# EAGLE design motor7 (EAGLE 6.1)

## Sheet 1 of 3
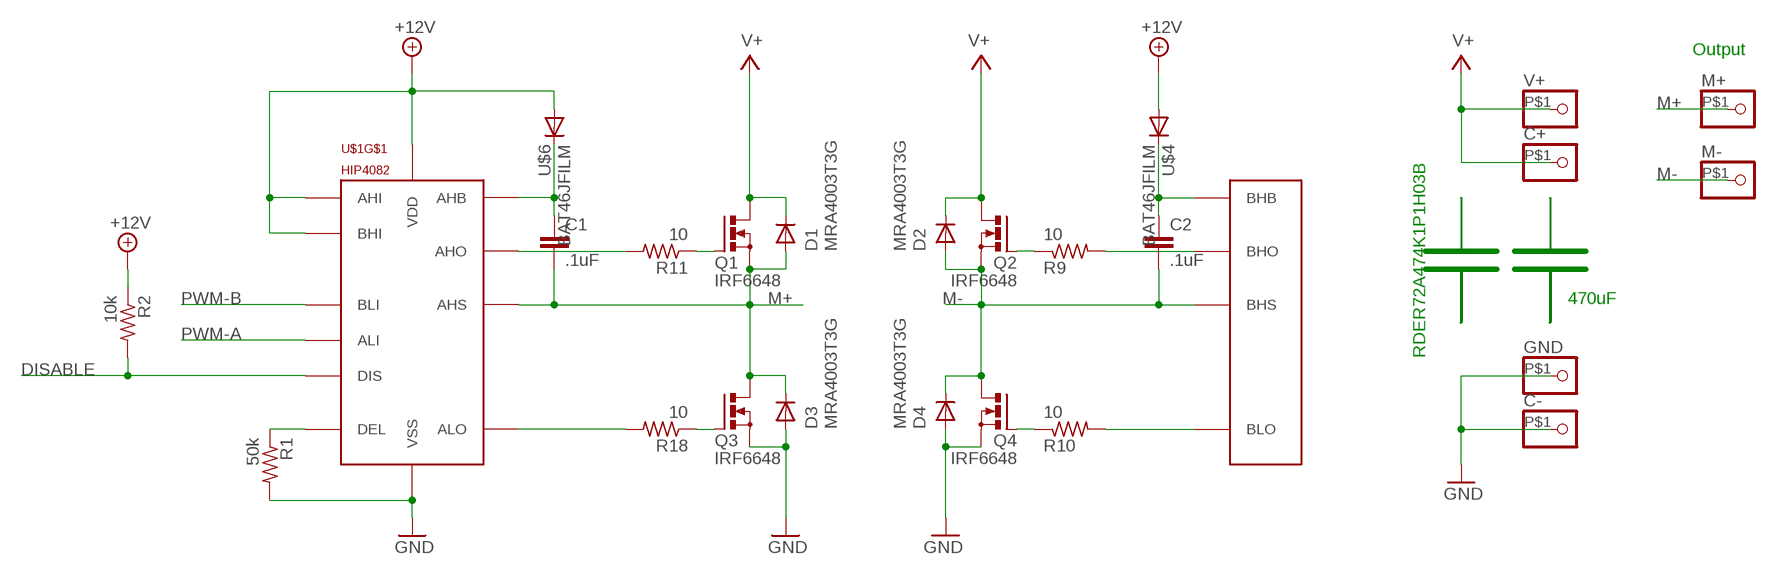
[diagram p0: schematic, sheet 1]

### Parts
C1  .1uF  C-EUC0603  [C0603]
C2  .1uF  C-EUC0603  [C0603]
C+  PINHD-1X1  [1X01]
C-  PINHD-1X1  [1X01]
D1  MRA4003T3G  [SMA]
D2  MRA4003T3G  [SMA]
D3  MRA4003T3G  [SMA]
D4  MRA4003T3G  [SMA]
GND  PINHD-1X1  [1X01]
M+  PINHD-1X1  [1X01]
M-  PINHD-1X1  [1X01]
Q1  IRF6648  [DIRECTFET-MOD]
Q2  IRF6648  [DIRECTFET-MOD]
Q3  IRF6648  [DIRECTFET]
Q4  IRF6648  [DIRECTFET]
R1  50k  R-US_R0603  [R0603]
R2  10k  R-US_R0603  [R0603]
R9  10  R-US_R0603  [R0603]
R10  10  R-US_R0603  [R0603]
R11  10  R-US_R0603  [R0603]
R18  10  R-US_R0603  [R0603]
U$1  HIP4082  [SOIC16]
U$4  BAT46JFILM  [SOD323]
U$6  BAT46JFILM  [SOD323]
V+  PINHD-1X1  [1X01]

### Nets
+12V: R2.1 U$1.2(BHI) U$1.7(AHI) U$1.12(VDD) U$4.2(A) U$6.2(A) ; also sheet 3
+48V: C+.P$1 D1.C D2.C Q1.D@1(D) Q1.D@2(D) Q1.D@3(D) Q1.D@4(D) Q2.D@1(D) Q2.D@2(D) Q2.D@3(D) Q2.D@4(D) V+.P$1 ; supply symbol labelled V+ ; also sheet 3
DISABLE: R2.2 U$1.8(DIS) ; also sheet 2
GND: C-.P$1 D3.A D4.A GND.P$1 Q3.S@1(S) Q3.S@2(S) Q4.S@1(S) Q4.S@2(S) R1.2 U$1.6(VSS) ; also sheet 2,3
M+: C1.2 D1.A D3.C M+.P$1 Q1.S@1(S) Q1.S@2(S) Q3.D@1(D) Q3.D@2(D) Q3.D@3(D) Q3.D@4(D) U$1.11(AHS)
M-: C2.2 D2.A D4.C M-.P$1 Q2.S@1(S) Q2.S@2(S) Q4.D@1(D) Q4.D@2(D) Q4.D@3(D) Q4.D@4(D) U$1.15(BHS)
N$2: C1.1 U$1.9(AHB) U$6.1(C)
N$3: R11.2 U$1.10(AHO)
N$4: R18.2 U$1.13(ALO)
N$6: C2.1 U$1.1(BHB) U$4.1(C)
N$7: Q1.G R11.1
N$12: R10.2 U$1.14(BLO)
N$13: R9.2 U$1.16(BHO)
N$21: Q3.G R18.1
N$29: Q2.G R9.1
N$30: Q4.G R10.1
N$31: R1.1 U$1.5(DEL)
PWM-A: U$1.4(ALI) ; also sheet 2
PWM-B: U$1.3(BLI) ; also sheet 2

### Notes on the sheet
- Output
- 470uF
- RDER72A474K1P1H03B

## Sheet 2 of 3
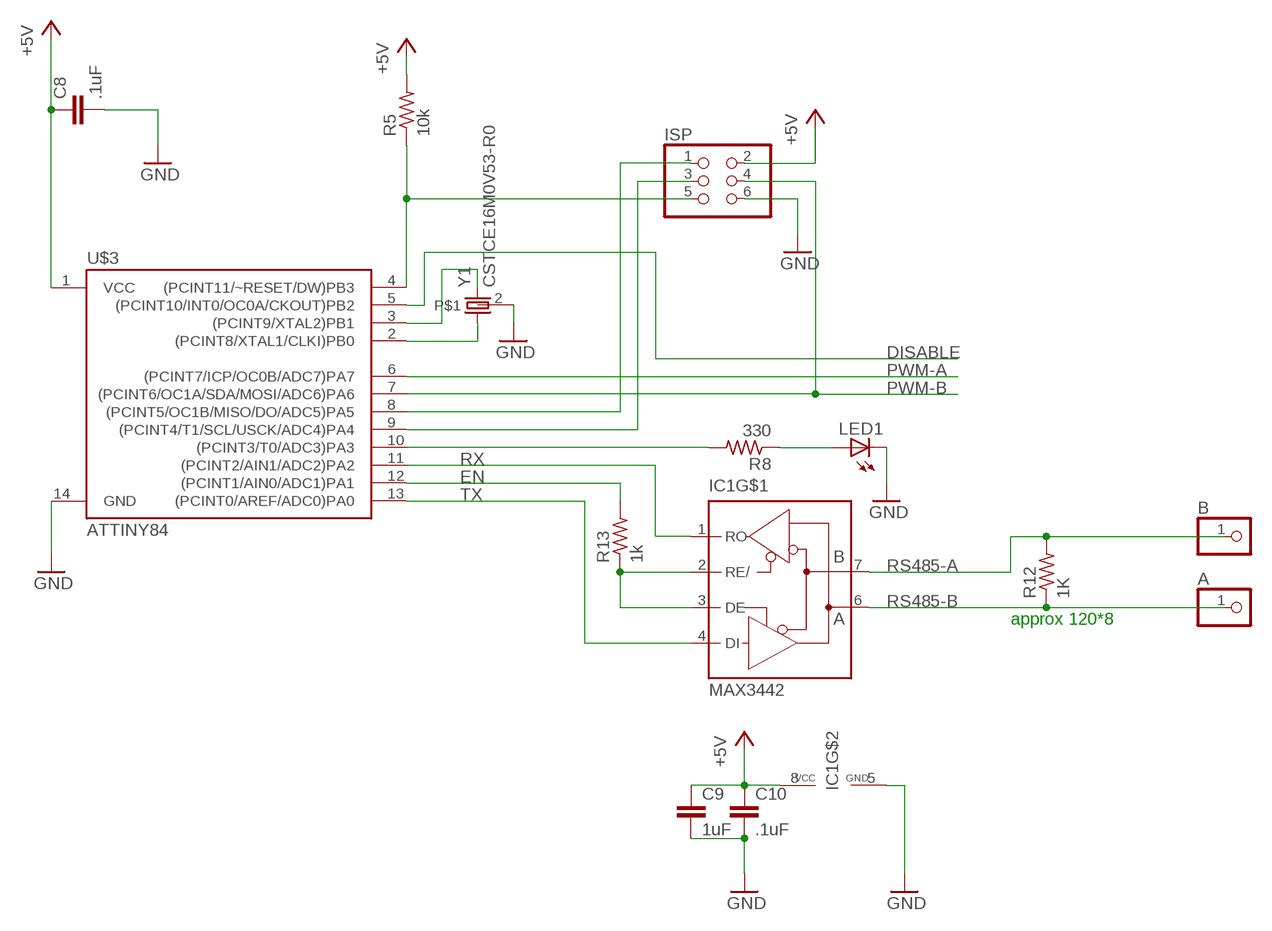
[diagram p1: schematic, sheet 2]

### Parts
A  PINHD-1X1  [1X01]
B  PINHD-1X1  [1X01]
C8  .1uF  C-EUC0603  [C0603]
C9  1uF  C-EUC0603  [C0603]
C10  .1uF  C-EUC0603  [C0603]
IC1  MAX3442  [SO08]
ISP  PINHD-2X3  [2X03]
LED1  LEDCHIPLED_0603  [CHIPLED_0603]
R5  10k  R-US_R0603  [R0603]
R8  330  R-US_R0603  [R0603]
R12  1K  R-US_R0603  [R0603]
R13  1k  R-US_R0603  [R0603]
U$3  ATTINY84  [SO14]
Y1  CSTCE16M0V53-R0  [MYSMD2_RESONATOR]

### Nets
23JOIJO: ISP.1 U$3.8((PCINT5/OC1B/MISO/DO/ADC5)PA5)
+5V: C8.1 C9.1 C10.1 IC1.8(VCC) ISP.2 R5.2 U$3.1(VCC) ; also sheet 3
DISABLE: U$3.5((PCINT10/INT0/OC0A/CKOUT)PB2) ; also sheet 1
EN: R13.2 U$3.12((PCINT1/AIN0/ADC1)PA1)
GND: C8.2 C9.2 C10.2 IC1.5(GND) ISP.6 LED1.C U$3.14(GND) Y1.2 ; also sheet 1,3
N$14: IC1.2(RE/) IC1.3(DE) R13.1
N$16: U$3.2((PCINT8/XTAL1/CLKI)PB0) Y1.1
N$18: R8.2 U$3.10((PCINT3/T0/ADC3)PA3)
N$24: U$3.3((PCINT9/XTAL2)PB1) Y1.3
N$26: LED1.A R8.1
N$33: ISP.5 R5.1 U$3.4((PCINT11/~RESET/DW)PB3)
OIJWOIJ3: ISP.3 U$3.9((PCINT4/T1/SCL/USCK/ADC4)PA4)
PWM-A: U$3.6((PCINT7/ICP/OC0B/ADC7)PA7) ; also sheet 1
PWM-B: ISP.4 U$3.7((PCINT6/OC1A/SDA/MOSI/ADC6)PA6) ; also sheet 1
RS485-A: B.1 IC1.7(B) R12.2
RS485-B: A.1 IC1.6(A) R12.1
RX: IC1.1(RO) U$3.11((PCINT2/AIN1/ADC2)PA2)
TX: IC1.4(DI) U$3.13((PCINT0/AREF/ADC0)PA0)

### Notes on the sheet
- approx 120*8

## Sheet 3 of 3
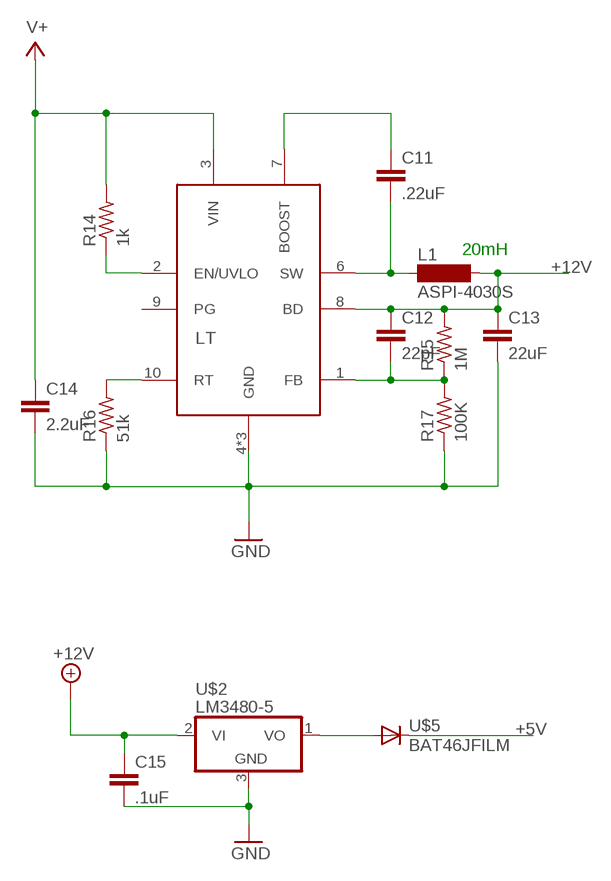
[diagram p2: schematic, sheet 3]

### Parts
C11  .22uF  C-EUC0603  [C0603]
C12  22pF  C-EUC0603  [C0603]
C13  22uF  C-EUC0805  [C0805]
C14  2.2uF  C-EUC0603  [C0603]
C15  .1uF  C-EUC0603  [C0603]
L1  ASPI-4030S  [ASPI-4030S]
LT  LT3990  [DFN10-3X3]
R14  1k  R-US_R0603  [R0603]
R15  1M  R-US_R0603  [R0603]
R16  51k  R-US_R0603  [R0603]
R17  100K  R-US_R0603  [R0603]
U$2  LM3480-5  [SOT23]
U$5  BAT46JFILM  [SOD323]

### Nets
+5V: U$5.1(C) ; also sheet 2
+12V: C12.1 C13.1 C15.1 L1.P$2 LT.8(BD) R15.2 U$2.2(VI) ; also sheet 1
+48V: C14.1 LT.3(VIN) R14.2 ; supply symbol labelled V+ ; also sheet 1
GND: C13.2 C14.2 C15.2 LT.4(GND) LT.5(GND) LT.EXP(GND) R16.1 R17.1 U$2.3(GND) ; also sheet 1,2
N$10: C11.1 LT.7(BOOST)
N$15: C11.2 L1.P$1 LT.6(SW)
N$17: C12.2 LT.1(FB) R15.1 R17.2
N$22: LT.10(RT) R16.2
N$25: U$2.1(VO) U$5.2(A)
N$27: LT.2(EN/UVLO) R14.1
Unconnected: LT.9(PG)

### Notes on the sheet
- 20mH

## Library data of the parts
A B = pinhead:PINHD-1X1: PIN HEADER
C1 C2 C8-C15 = rcl:C-EU: CAPACITOR, European symbol
C+ C- GND M+ M- V+ = evan:PINHD-1X1: PIN HEADER
D1-D4 = evan:MRA4003T3G
IC1 = evan:MAX3442: RS485 TRANSEIVER; MF: MAXIM; MPN: MAX481CSA; OC_FARNELL: unknown; OC_NEWARK: 90C3817
ISP = pinhead:PINHD-2X3: PIN HEADER
L1 = evan:ASPI-4030S
LED1 = led:LED: LED OSRAM: - CHIPLED LG R971, LG N971, LY N971, LG Q971, LY Q971, LO R971, LY R971 LH N974, LH R974 LS Q976, LO Q976, LY Q976 LO Q996 - Hyper CHIPLED LW Q18S LB Q993, LB Q99A, LB R99A - SideLED LS A670, LO A670, LY A670, LG A670, LP A670 LB A673, LV A673, LT A673, LW A673 LH A674 LY A675 LS A676, LA A676, LO A676, LY A676, LW A676 LS A679, LY A679, LG A679 - Hyper Micro SIDELED® LS Y876, LA Y876, LO Y876, LY Y876 LT Y87S - SmartLED LW L88C, LW L88S LB L89C, LB L89S, LG L890 LS L89K, LO L89K, LY L89K LS L896, LA L896, LO L896, LY L896 - TOPLED LS T670, LO T670, LY T670, LG T670, LP T670 LSG T670, LSP T670, LSY T670, LOP T670, LYG T670 LG T671, LOG T671, LSG T671 LB T673, LV T673, LT T673, LW T673 LH T674 LS T676, LA T676, LO T676, LY T676, LB T676, LH T676, LSB T676, LW T676 LB T67C, LV T67C, LT T67C, LS T67K, LO T67K, LY T67K, LW E67C LS E67B, LA E67B, LO E67B, LY E67B, LB E67C, LV E67C, LT E67C LW T67C LS T679, LY T679, LG T679 LS T770, LO T770, LY T770, LG T770, LP T770 LB T773, LV T773, LT T773, LW T773 LH T774 LS E675, LA E675, LY E675, LS T675 LS T776, LA T776, LO T776, LY T776, LB T776 LHGB T686 LT T68C, LB T68C - Hyper Mini TOPLED® LB M676 - Mini TOPLED Santana® LG M470 LS M47K, LO M47K, LY M47K Source: http://www.osram.convergy.de LUXEON: - LUMILED® LXK2-PW12-R00, LXK2-PW12-S00, LXK2-PW14-U00, LXK2-PW14-V00 LXK2-PM12-R00, LXK2-PM12-S00, LXK2-PM14-U00 LXK2-PE12-Q00, LXK2-PE12-R00, LXK2-PE12-S00, LXK2-PE14-T00, LXK2-PE14-U00 LXK2-PB12-K00, LXK2-PB12-L00, LXK2-PB12-M00, LXK2-PB14-N00, LXK2-PB14-P00, LXK2-PB14-Q00 LXK2-PR12-L00, LXK2-PR12-M00, LXK2-PR14-Q00, LXK2-PR14-R00 LXK2-PD12-Q00, LXK2-PD12-R00, LXK2-PD12-S00 LXK2-PH12-R00, LXK2-PH12-S00 LXK2-PL12-P00, LXK2-PL12-Q00, LXK2-PL12-R00 Source: www.luxeon.com KINGBRIGHT: KA-3528ASYC Source: www.kingbright.com
LT = evan:LT3990: http://cds.linear.com/docs/en/datasheet/3990fa.pdf
Q1 Q2 = evan:IRF6648: DirectFET Power MOSFET Source: http://www.irf.com/product-info/datasheets/data/irf6648.pdf
Q3 Q4 = transistor-power:IRF6648: DirectFET Power MOSFET Source: http://www.irf.com/product-info/datasheets/data/irf6648.pdf
R1 R2 R5 R8-R18 = rcl:R-US_: RESISTOR, American symbol
U$1 = evan:HIP4082
U$2 = evan:LM3480-5
U$3 = evan:ATTINY84: Atmel 14-pin 2/4/8kB flash uC
U$4-U$6 = evan:BAT46JFILM
Y1 = evan:CSTCE16M0V53-R0

## Board
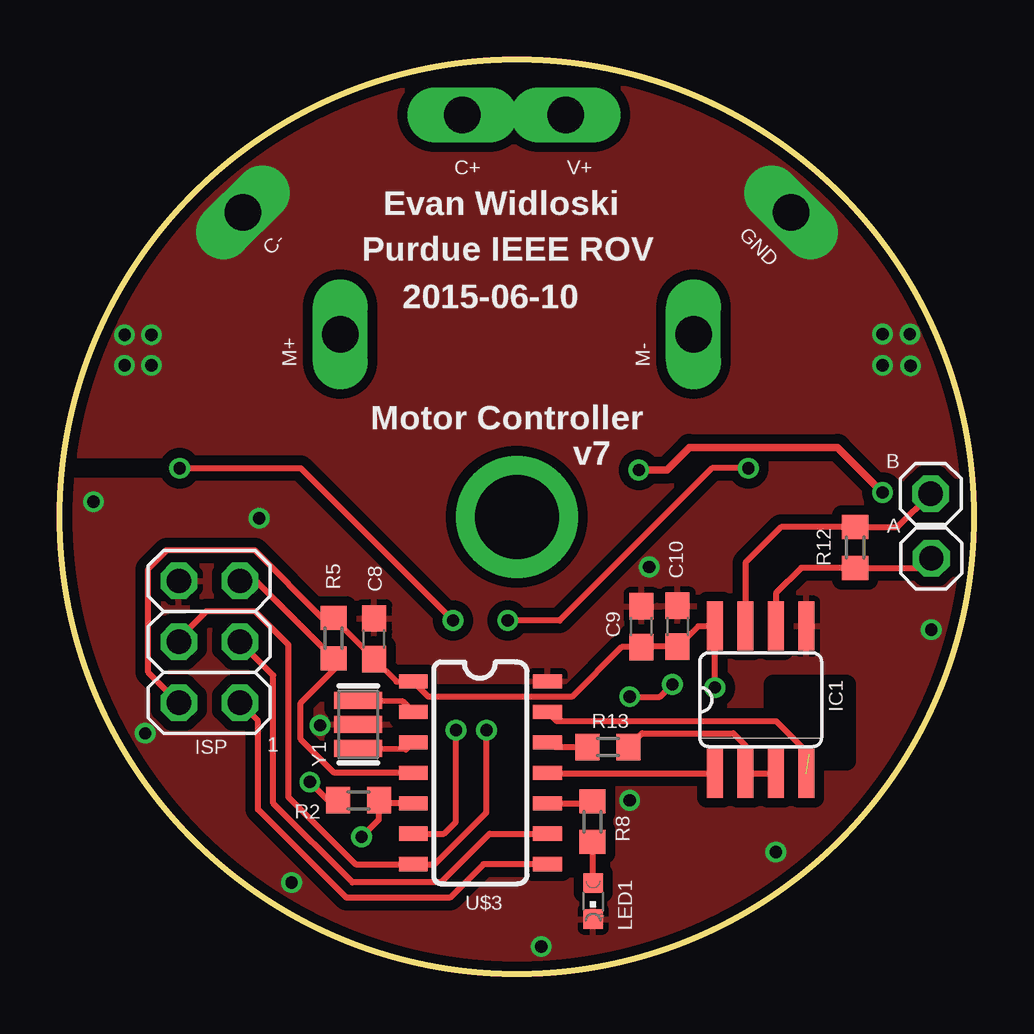
[diagram p3: board, top side]
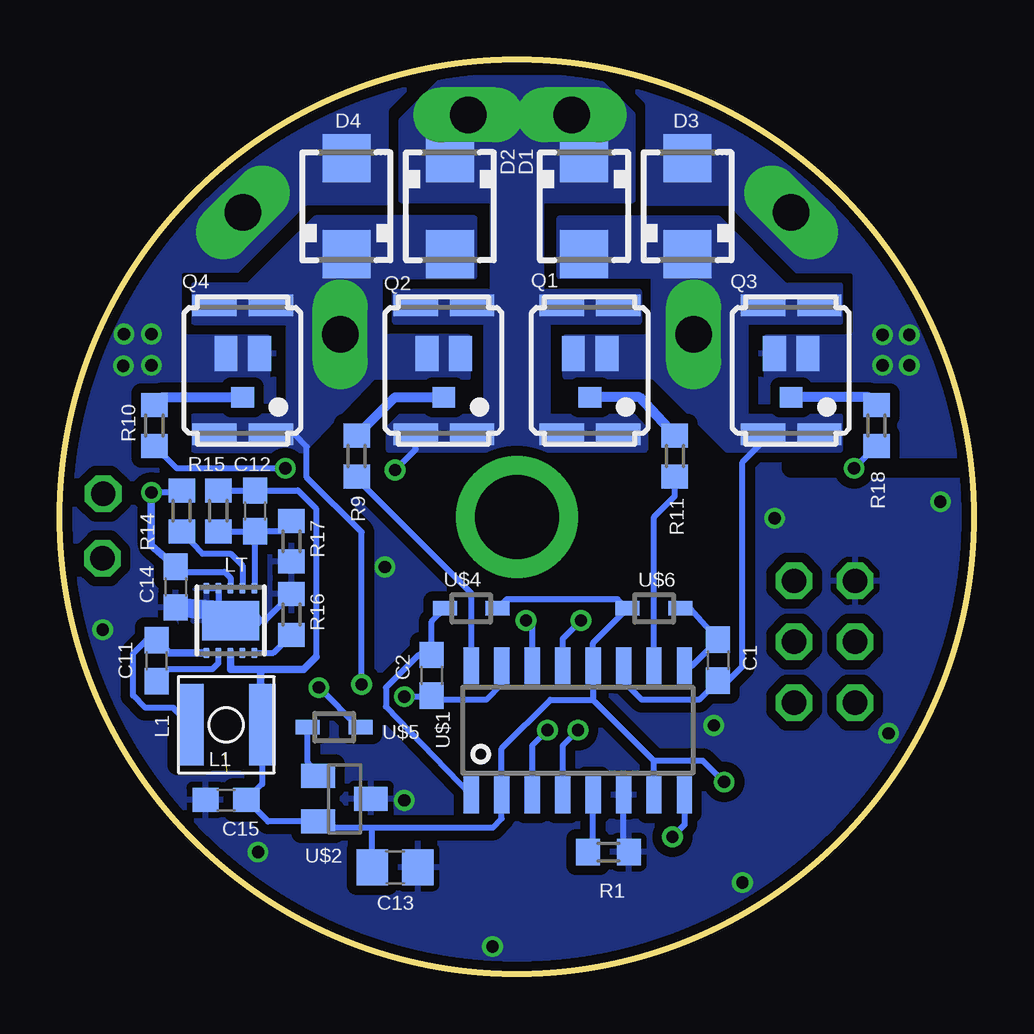
[diagram p4: board, bottom side, seen from below]

Size 38.1 x 38.1 mm. Coordinates in mm from the lower left corner, seen from the top.
Outline: circle at 19.05,19.05 radius 19.05
Copper layers (1*16): Top 0.0356mm / dielectric 1.5011mm / Bottom 0.0356mm
Design rules: minimum track width 6mil, minimum drill 13mil, track to track 6mil, track to pad 6mil, pad to pad 6mil, via to via 6mil, smd to smd 6mil, copper to edge 15mil, drill to drill 6mil, minimum pad ring 7mil, minimum via ring 7mil, stop-mask expansion 3mil, vias tented up to drill 0mil, thermal gap 10mil
tRestrict: area 29.7,8.9 to 32.8,12.1; 1 lines
bRestrict: area 29.7,8.9 to 32.8,12.1; 1 lines

### Footprints (pad centres in the part's own frame; a part is rotated, then mirrored left to right if it is on the bottom)
1X01 = drill 1.016 octagon: 1 0,0
C0603 = smd 1.1 x 1: 1 -0.85,0; 2 0.85,0
C0805 = smd 1.3 x 1.5: 1 -0.95,0; 2 0.95,0
1X01' = drill 1.524 pad 1.676 long: P$1 0,0
SMA = smd 2 x 2: A 2,0; C -2,0
SO08 = smd 0.66 x 2.032: 1 -1.905,-3.073; 2 -0.635,-3.073; 3 0.635,-3.073; 4 1.905,-3.073; 5 1.905,3.073; 6 0.635,3.073; 7 -0.635,3.073; 8 -1.905,3.073
2X03 = drill 1.016 octagon: 1 -2.54,-1.27; 2 -2.54,1.27; 3 0,-1.27; 4 0,1.27; 5 2.54,-1.27; 6 2.54,1.27
ASPI-4030S = smd 1.1 x 3.4: P$1 -1.5,0; P$2 1.5,0
CHIPLED_0603 = smd 0.8 x 0.8: A 0,-0.75; C 0,0.75
DFN10-3X3 = smd 0.25 x 0.45: 1 -1,-1.35; 2 -0.5,-1.35; 3 0,-1.35; 4 0.5,-1.35; 5 1,-1.35; 6 1,1.35; 7 0.5,1.35; 8 0,1.35; 9 -0.5,1.35; 10 -1,1.35 | smd 2.38 x 1.65: EXP 0,0
DIRECTFET-MOD = smd 0.9 x 1.85: D@1 -2.656,1.176; D@2 -2.656,-1.174; D@3 2.724,1.176; D@4 2.724,-1.174 | smd 0.85 x 0.95: G -1.101,0.002 | smd 1.45 x 0.95: S@1 0.719,0.701; S@2 0.719,-0.699
R0603 = smd 1 x 1.1: 1 -0.85,0; 2 0.85,0
SOIC16 = smd 0.635 x 1.524: 1 -4.445,-2.695; 2 -3.175,-2.695; 3 -1.905,-2.695; 4 -0.635,-2.695; 5 0.635,-2.695; 6 1.905,-2.695; 7 3.175,-2.695; 8 4.445,-2.695; 9 4.445,2.695; 10 3.175,2.695; 11 1.905,2.695; 12 0.635,2.695; 13 -0.635,2.695; 14 -1.905,2.695; 15 -3.175,2.695; 16 -4.445,2.695
SOT23 = smd 1 x 1.4: 1 -0.95,-1.1; 2 0.95,-1.1; 3 0,1.1
SO14 = smd 0.6 x 1.2: 1 -3.81,-2.8; 2 -2.54,-2.8; 3 -1.27,-2.8; 4 0,-2.8; 5 1.27,-2.8; 6 2.54,-2.8; 7 3.81,-2.8; 8 3.81,2.8; 9 2.54,2.8; 10 1.27,2.8; 11 0,2.8; 12 -1.27,2.8; 13 -2.54,2.8; 14 -3.81,2.8
SOD323 = smd 1 x 0.6: 1 -1.1,0; 2 1.1,0
MYSMD2_RESONATOR = smd 0.7 x 2: 1 -1,0; 2 0,0; 3 1,0

### Placement (x,y rotation side)
A  36.32,17.32 0 top
B  36.3,20.02 0 top
C1  10.67,13.08 270 bottom
C2  22.61,12.45 270 bottom
C8  13.09,13.97 90 top
C9  24.24,14.48 90 top
C10  25.75,14.49 90 top
C11  34.06,13.06 90 bottom
C12  29.97,19.3 270 bottom
C13  24.13,4.45 0 bottom
C14  33.27,16.13 270 bottom
C15  31.18,7.26 180 bottom
C+  [1X01']  21.08,35.81 0 top
C-  [1X01']  7.62,31.75 45 top
D1  16.26,32 270 bottom
D2  21.84,32 270 bottom
D3  11.94,32 90 bottom
D4  26.16,32 90 bottom
GND  [1X01']  30.48,31.75 135 top
IC1  29.21,11.43 0 top
ISP  6.22,13.84 90 top
L1  31.17,10.39 0 bottom
LED1  22.23,3.04 180 top
LT  30.99,14.73 180 bottom
M+  [1X01']  11.68,26.67 90 top
M-  [1X01']  26.42,26.67 90 top
Q1  16,25.15 90 bottom
Q2  22.1,25.15 90 bottom
Q3  IRF6648  [DIRECTFET-MOD]  7.62,25.15 90 bottom
Q4  IRF6648  [DIRECTFET-MOD]  30.48,25.15 90 bottom
R1  15.24,5.08 0 bottom
R2  12.45,7.24 0 top
R5  11.4,14 90 top
R8  22.2,6.35 90 top
R9  25.73,21.59 270 bottom
R10  34.16,22.86 270 bottom
R11  12.47,21.59 270 bottom
R12  33.15,17.78 90 top
R13  22.84,9.46 180 top
R14  33.02,19.3 90 bottom
R15  31.5,19.3 90 bottom
R16  28.45,14.99 270 bottom
R17  28.45,18.03 90 bottom
R18  4.06,22.86 270 bottom
U$1  16.51,10.16 0 bottom
U$2  26.24,7.3 270 bottom
U$3  17.53,8.38 270 top
U$4  20.96,15.24 0 bottom
U$5  26.67,10.29 180 bottom
U$6  13.34,15.24 180 bottom
V+  [1X01']  16.76,35.81 0 top
Y1  12.43,10.4 270 top

### Tracks (layer width: path | path; a pad name or v marks a point on that pad's centre or on a via)
23JOIJO
  Top 0.254: U$3.8 17.65,4.57 16.26,3.18 11.94,3.18 8.26,6.86 8.26,10.54 ISP.1
+5V  (via drill 0.51)
  Top 0.254: 14.57,12.35 U$3.1 | ISP.2 3.68,12.57 3.68,16.89 4.45,17.65 8.13,17.65 10.94,14.85 R5.2 11.43,14.82 C8.1 14.02,12.19 U$3.1 | v27.3,11.94 IC1.8 26.61,14.5 C10.1 24.26,13.64 C9.1 23.41,13.63 21.34,11.56 15.36,11.56 U$3.1
  Bottom 0.254: U$5.1 25.65,10.29 v27.3,11.94
+12V  (via drill 0.51)
  Top 0.254: R2.1 11.18,7.24 v10.41,8
  Bottom 0.254: 27.43,13.21 27.43,19.41 28.18,20.15 C12.1 R15.2 | 30.5,7.18 C15.1 | 29.74,10.47 L1.P$2 29.67,7.92 C15.1 | 15.88,11.43 U$1.12 15.88,13.8 U$6.2 14.48,15.24 14.86,15.62 19.47,15.62 U$4.2 | U$1.7 13.34,8.89 | 13.34,8.89 15.88,11.43 | 15.88,11.43 17.65,11.43 19.69,9.4 U$1.2 19.69,6.48 20.07,6.1 25.15,6.1 | 30.31,7.24 C15.1 | 25.15,6.1 26.96,6.1 U$2.2 29.42,6.35 C15.1 | C13.1 25.08,6.03 25.15,6.1 | v10.41,8 11.3,8.89 13.34,8.89
  Bottom 0.305: LT.8 30.99,12.7 29.74,12.7 | 27.43,13.21 27.94,12.7 29.74,12.7 | 29.74,10.47 29.74,12.7
+48V  (via drill 0.51)
  Top 0.305: v24.13,21.01 25.3,21.01 26.24,21.95 32.41,21.95 v34.29,20.07
  Bottom 0.254: C14.1 33.19,16.76 31.24,16.76 30.99,16.51 LT.3 | R14.2 33.11,20.07 v34.29,20.07 | v24.13,21.01 23.27,21.86 Q2.D@1
  Bottom 0.305: v34.29,20.07 34.29,17.87 C14.1
  pour Bottom (isolate 0.406, rank 2, no thermals): 15.75,37.34 22.1,37.34 23.88,35.56 23.88,32.26 20.07,32.26 20.07,28.19 18.03,28.19 18.03,32.26 14.22,32.26 14.22,35.81
  pour Bottom (isolate 0.406, rank 2, no thermals): 17.78,23.24 13.72,23.24 13.72,21.84 24.38,21.84 24.38,23.24 20.32,23.24 20.32,27.18 24.13,27.18 24.13,28.45 13.97,28.45 13.97,27.18 17.78,27.18
DISABLE  (via drill 0.51)
  Top 0.254: U$3.5 13.42,7.11 R2.2 13.3,6.44 v12.57,5.71
  Bottom 0.254: U$1.8 12.07,6.22 v12.57,5.71
EN
  Top 0.254: U$3.12 20.39,9.71 20.64,9.46 R13.2
GND  (via drill 0.51)
  Bottom 0.254: LT.5 LT.4 31.49,15.23 31.41,15.15 | 29.97,14.73 29.55,14.73 R16.1 | R1.2 14.61,5.29 U$1.6
  Bottom 0.61: LT.EXP 29.97,14.73
  Bottom 0.813: C14.2 31.41,15.15 LT.EXP
  other vias: 20.07,1.14 3.81,26.64 2.69,26.64 3.81,25.37 2.69,25.37 8.31,19 34.29,25.37 34.29,26.67 35.43,26.67 35.46,25.35 36.32,14.35 10.85,10.36 23.75,7.24 29.84,5.08 9.65,3.81 3.56,10.03 1.4,19.69 24.56,16.97
  pour Bottom (isolate 0.406, rank 2, no thermals): 33.27,26.54 29.46,26.54 29.46,24.89 33.27,24.89
  pour Bottom (isolate 0.406, rank 3): 19.05,38.1 arc-90 38.1,19.05 arc-90 19.05,0 arc-90 0,19.05 arc-90
  pour Top (isolate 0.406): 19.05,38.1 arc-90 38.1,19.05 arc-90 19.05,0 arc-90 0,19.05 arc-90
  pour Bottom (isolate 0.406, rank 2, no thermals): 8.64,26.54 4.83,26.54 4.83,24.89 8.64,24.89
  pour Bottom (no thermals): 10.29,32.77 13.34,32.77 13.34,35.43 10.29,35.43
  pour Bottom (no thermals): 24.77,32.77 27.81,32.77 27.81,35.43 24.77,35.43
  pour Top (no thermals): 6.25,30.96 6.88,30.33 7.9,30.33 8.53,30.96 8.53,32.23 7.9,32.87 6.88,32.87 6.25,32.23
  pour Bottom (no thermals): 6.25,30.96 6.88,30.33 7.9,30.33 8.53,30.96 8.53,32.23 7.9,32.87 6.88,32.87 6.25,32.23
M+
  Bottom 0.254: U$1.11 14.61,12.19 13.84,11.43 11.47,11.43 C1.2 10.63,12.19 10.29,12.19 9.65,12.83 9.65,21.34 8.8,22.19 Q3.D@1
  pour Bottom (isolate 0.406, rank 2, no thermals): 5.59,21.84 10.29,21.84 13.34,24.89 17.02,24.89 17.02,26.54 13.34,26.54 13.34,29.08 17.27,29.08 17.27,31.5 10.67,31.5 7.87,28.7 5.59,28.7 5.59,27.18 9.53,27.18 9.53,23.24 5.59,23.24
M-  (via drill 0.51)
  Top 0.254: v23.75,11.56 25.02,11.56 v25.53,12.07
  Bottom 0.254: U$1.15 19.69,12.07 20.32,11.43 22.44,11.43 C2.2 22.64,11.56 v23.75,11.56 | 28.97,22.49 Q4.D@2 29.29,22.48 28.32,22.48 27.81,21.97 27.81,20.7 25.53,18.41 v25.53,12.07
  pour Bottom (isolate 0.406, rank 2, no thermals): 32.51,21.84 27.94,21.84 25.02,24.89 21.08,24.89 21.08,26.54 24.77,26.54 24.77,29.08 20.83,29.08 20.83,31.5 27.43,31.5 30.23,28.7 32.51,28.7 32.51,27.18 28.58,27.18 28.58,23.24 32.51,23.24
N$2
  Bottom 0.254: U$6.1 11.85,15.24 C1.1 11.74,12.86 U$1.9
N$3
  Bottom 0.254: U$1.10 13.34,19.05 12.47,19.91 R11.2
N$4  (via drill 0.51)
  Top 0.254: v16.38,14.73 10.03,21.08 v4.99,21.08
  Bottom 0.254: v4.99,21.08 R18.2 | v16.38,14.73 17.14,13.97 U$1.13
N$6
  Bottom 0.254: U$4.1 22.61,14.69 C2.1 23.15,13.3 24.51,11.94 24.51,11.15 U$1.1
N$7
  Bottom 0.406: R11.1 13.95,24.05 Q1.G
N$9  (via drill 3.5 pad 5.08)
  other vias: 19.05,19.05
N$10
  Bottom 0.254: LT.7 31.5,12.95 31.75,12.7 33.57,12.7 C11.1
N$12  (via drill 0.51)
  Top 0.254: v18.67,14.73 20.83,14.73 27.18,21.08 v28.7,21.08
  Bottom 0.254: R10.2 33.23,21.08 v28.7,21.08 | v18.67,14.73 18.41,14.48 U$1.14
N$13
  Bottom 0.254: R9.2 25.73,20.65 20.96,15.88 U$1.16
N$14
  Top 0.254: R13.1 24.26,10.03 28.07,10.03 28.58,9.53 IC1.2 IC1.3
N$15
  Bottom 0.254: L1.P$1 33.38,11.1 34.54,11.1 35.05,11.61 35.05,13.36 34.51,13.91 C11.2
  Bottom 0.305: LT.6 33.54,13.38 C11.2
N$16
  Top 0.254: U$3.2 14.3,11.35 Y1.1
N$17
  Bottom 0.254: R17.2 28.88,18.45 C12.2 | C12.2 29.99,18.44 LT.1 | R15.1 C12.2
N$18
  Top 0.254: U$3.10 22.11,7.11 R8.2
N$21
  Bottom 0.406: R18.1 4.4,24.05 Q3.G
N$22
  Bottom 0.254: LT.10 29.2,13.38 R16.2
N$24
  Top 0.254: U$3.3 14.43,9.35 Y1.3
N$25
  Bottom 0.254: U$2.1 27.77,8.81 U$5.2
N$26
  Top 0.254: R8.1 22.2,3.81 LED1.A
N$27
  Bottom 0.254: R14.1 32.16,17.53 30.99,17.53 30.49,17.03 LT.2
N$29
  Bottom 0.406: R9.1 24.12,24.05 Q2.G
N$30
  Bottom 0.406: R10.1 33.83,24.05 Q4.G
N$31
  Bottom 0.254: R1.1 15.88,5.29 U$1.5
N$33
  Top 0.254: U$3.4 11.43,8.38 10.03,9.78 10.03,11.3 11.43,12.7 11.43,13.12 R5.1 8.17,16.38 ISP.5
OIJWOIJ3
  Top 0.254: U$3.9 17.91,5.84 15.88,3.81 12.19,3.81 8.89,7.11 8.89,12.45 ISP.3
PWM-A  (via drill 0.51)
  Top 0.254: U$3.6 16,5.84 16.51,6.35 v16.51,10.16
  Bottom 0.254: v16.51,10.16 17.14,9.53 U$1.4
PWM-B  (via drill 0.51)
  Top 0.254: v17.78,10.16 17.78,6.73 15.62,4.57 U$3.7 12.32,4.57 9.53,7.37 9.53,13.72 8.13,15.11 6.1,15.11 4.95,13.97 ISP.4
  Bottom 0.254: v17.78,10.16 18.41,9.53 U$1.3
RS485-A
  Top 0.254: B.1 34.91,18.63 R12.2 30.06,18.63 28.58,17.14 IC1.7
RS485-B
  Top 0.254: A.1 35.93,16.93 R12.1 30.9,16.93 29.84,15.88 IC1.6
RX
  Top 0.254: U$3.11 20.35,8.36 IC1.1
TX  (1 unrouted)
  Top 0.254: U$3.13 20.71,10.54 29.84,10.54 31.24,9.14

### Text on the board
tNames: 1
bNames: L1
_tsilk: Evan Widloski | Purdue IEEE ROV | 2015-06-10 | Motor Controller | v7